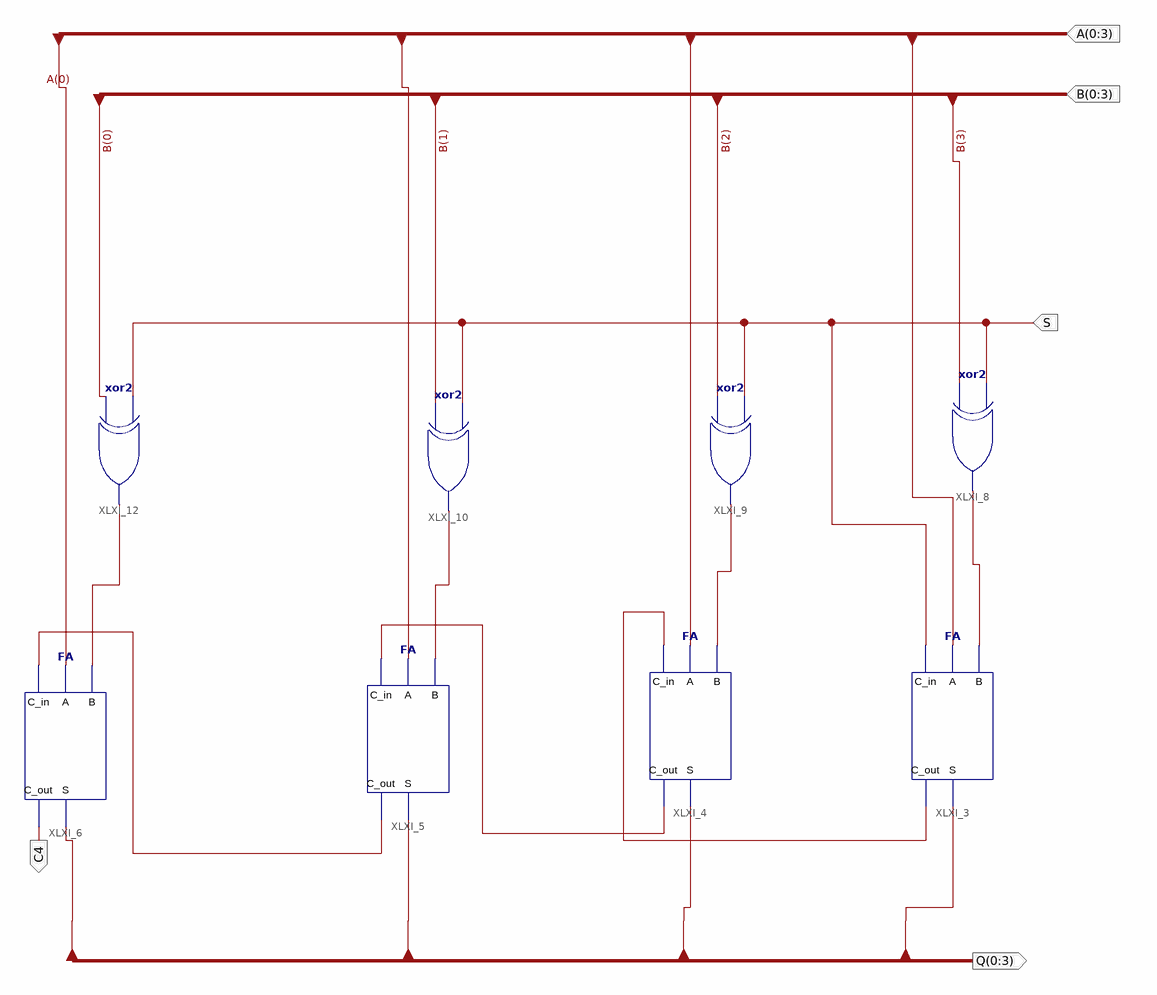
[diagram p0: schematic sheet 1]
// Xilinx ISE schematic FourBit_Adder_Subtracter.sch (spartan3e) as structural Verilog: 8 symbols, 5 ports
module FourBit_Adder_Subtracter (
  input  S,
  input  [0:3] A,
  input  [0:3] B,
  output C4,
  output [0:3] Q
);

  wire XLXN_3, XLXN_5, XLXN_9, XLXN_10, XLXN_20, XLXN_21, XLXN_22;

  FA XLXI_3 (.A(A[3]), .B(XLXN_10), .C_in(S), .C_out(XLXN_20), .S(Q[3]));
  FA XLXI_4 (.A(A[2]), .B(XLXN_9), .C_in(XLXN_20), .C_out(XLXN_21), .S(Q[2]));
  FA XLXI_5 (.A(A[1]), .B(XLXN_5), .C_in(XLXN_21), .C_out(XLXN_22), .S(Q[1]));
  FA XLXI_6 (.A(A[0]), .B(XLXN_3), .C_in(XLXN_22), .C_out(C4), .S(Q[0]));
  xor XLXI_8 (XLXN_10, B[3], S);
  xor XLXI_9 (XLXN_9, B[2], S);
  xor XLXI_10 (XLXN_5, B[1], S);
  xor XLXI_12 (XLXN_3, B[0], S);
endmodule
